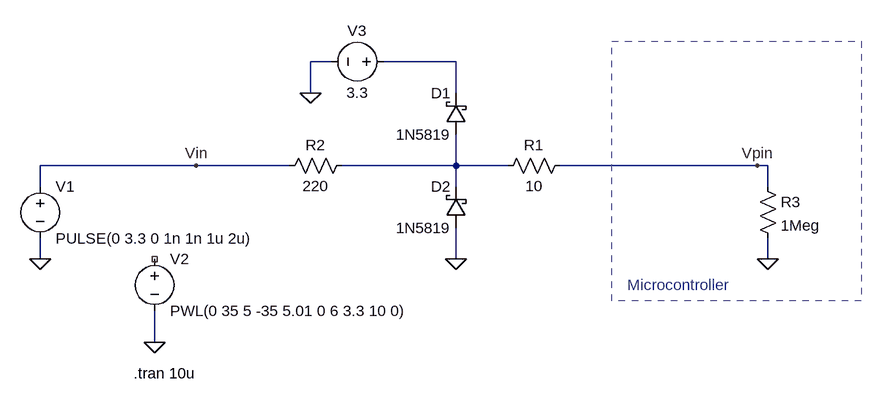
[diagram p0: schematic Digital Input Protection.asc]
Digital Input Protection.asc, the LTspice schematic file:
Version 4
SHEET 1 880 680
WIRE 48 -16 16 -16
WIRE 240 -16 128 -16
WIRE 16 32 16 -16
WIRE 240 32 240 -16
WIRE -160 144 -400 144
WIRE -16 144 -160 144
WIRE 240 144 240 96
WIRE 240 144 64 144
WIRE 320 144 240 144
WIRE 704 144 400 144
WIRE 720 144 704 144
WIRE -400 176 -400 144
WIRE 240 176 240 144
WIRE 720 176 720 144
WIRE -400 288 -400 256
WIRE 240 288 240 240
WIRE 720 288 720 256
WIRE -224 416 -224 368
FLAG 720 288 0
FLAG -224 416 0
FLAG 240 288 0
FLAG 16 32 0
FLAG 704 144 Vpin
FLAG -160 144 Vin
FLAG -400 288 0
SYMBOL schottky 256 96 R180
WINDOW 0 24 64 Left 2
WINDOW 3 24 0 Left 2
SYMATTR InstName D1
SYMATTR Value 1N5819
SYMATTR Description Diode
SYMATTR Type diode
SYMBOL res 416 128 R90
WINDOW 0 0 56 VBottom 2
WINDOW 3 32 56 VTop 2
SYMATTR InstName R1
SYMATTR Value 10
SYMBOL res 80 128 R90
WINDOW 0 0 56 VBottom 2
WINDOW 3 32 56 VTop 2
SYMATTR InstName R2
SYMATTR Value 220
SYMBOL res 704 160 R0
SYMATTR InstName R3
SYMATTR Value 1Meg
SYMBOL voltage -224 272 R0
WINDOW 123 0 0 Left 0
WINDOW 39 0 0 Left 0
SYMATTR InstName V2
SYMATTR Value PWL(0 35 5 -35 5.01 0 6 3.3 10 0)
SYMBOL voltage 144 -16 R90
WINDOW 0 -32 56 VBottom 2
WINDOW 3 32 56 VTop 2
WINDOW 123 0 0 Left 0
WINDOW 39 0 0 Left 0
SYMATTR InstName V3
SYMATTR Value 3.3
SYMBOL schottky 256 240 R180
WINDOW 0 24 64 Left 2
WINDOW 3 24 0 Left 2
SYMATTR InstName D2
SYMATTR Value 1N5819
SYMATTR Description Diode
SYMATTR Type diode
SYMBOL voltage -400 160 R0
WINDOW 123 0 0 Left 0
WINDOW 39 0 0 Left 0
SYMATTR InstName V1
SYMATTR Value PULSE(0 3.3 0 1n 1n 1u 2u)
TEXT -256 464 Left 2 !.tran 10u
TEXT 504 328 Left 2 ;Microcontroller
RECTANGLE Normal 864 352 480 -48 2

The netlist it stands for:
* Digital Input Protection.asc
D1 N002 N001 1N5819
R1 Vpin N002 10
R2 N002 Vin 220
R3 Vpin 0 1Meg
V2 NC_01 0 PWL(0 35 5 -35 5.01 0 6 3.3 10 0)
V3 N001 0 3.3
D2 0 N002 1N5819
V1 Vin 0 PULSE(0 3.3 0 1n 1n 1u 2u)
.model D D
.lib standard.dio
.tran 10u
* Microcontroller
.backanno
.end